# EAGLE design adafruit_breakout_shield (EAGLE 6.6.0)
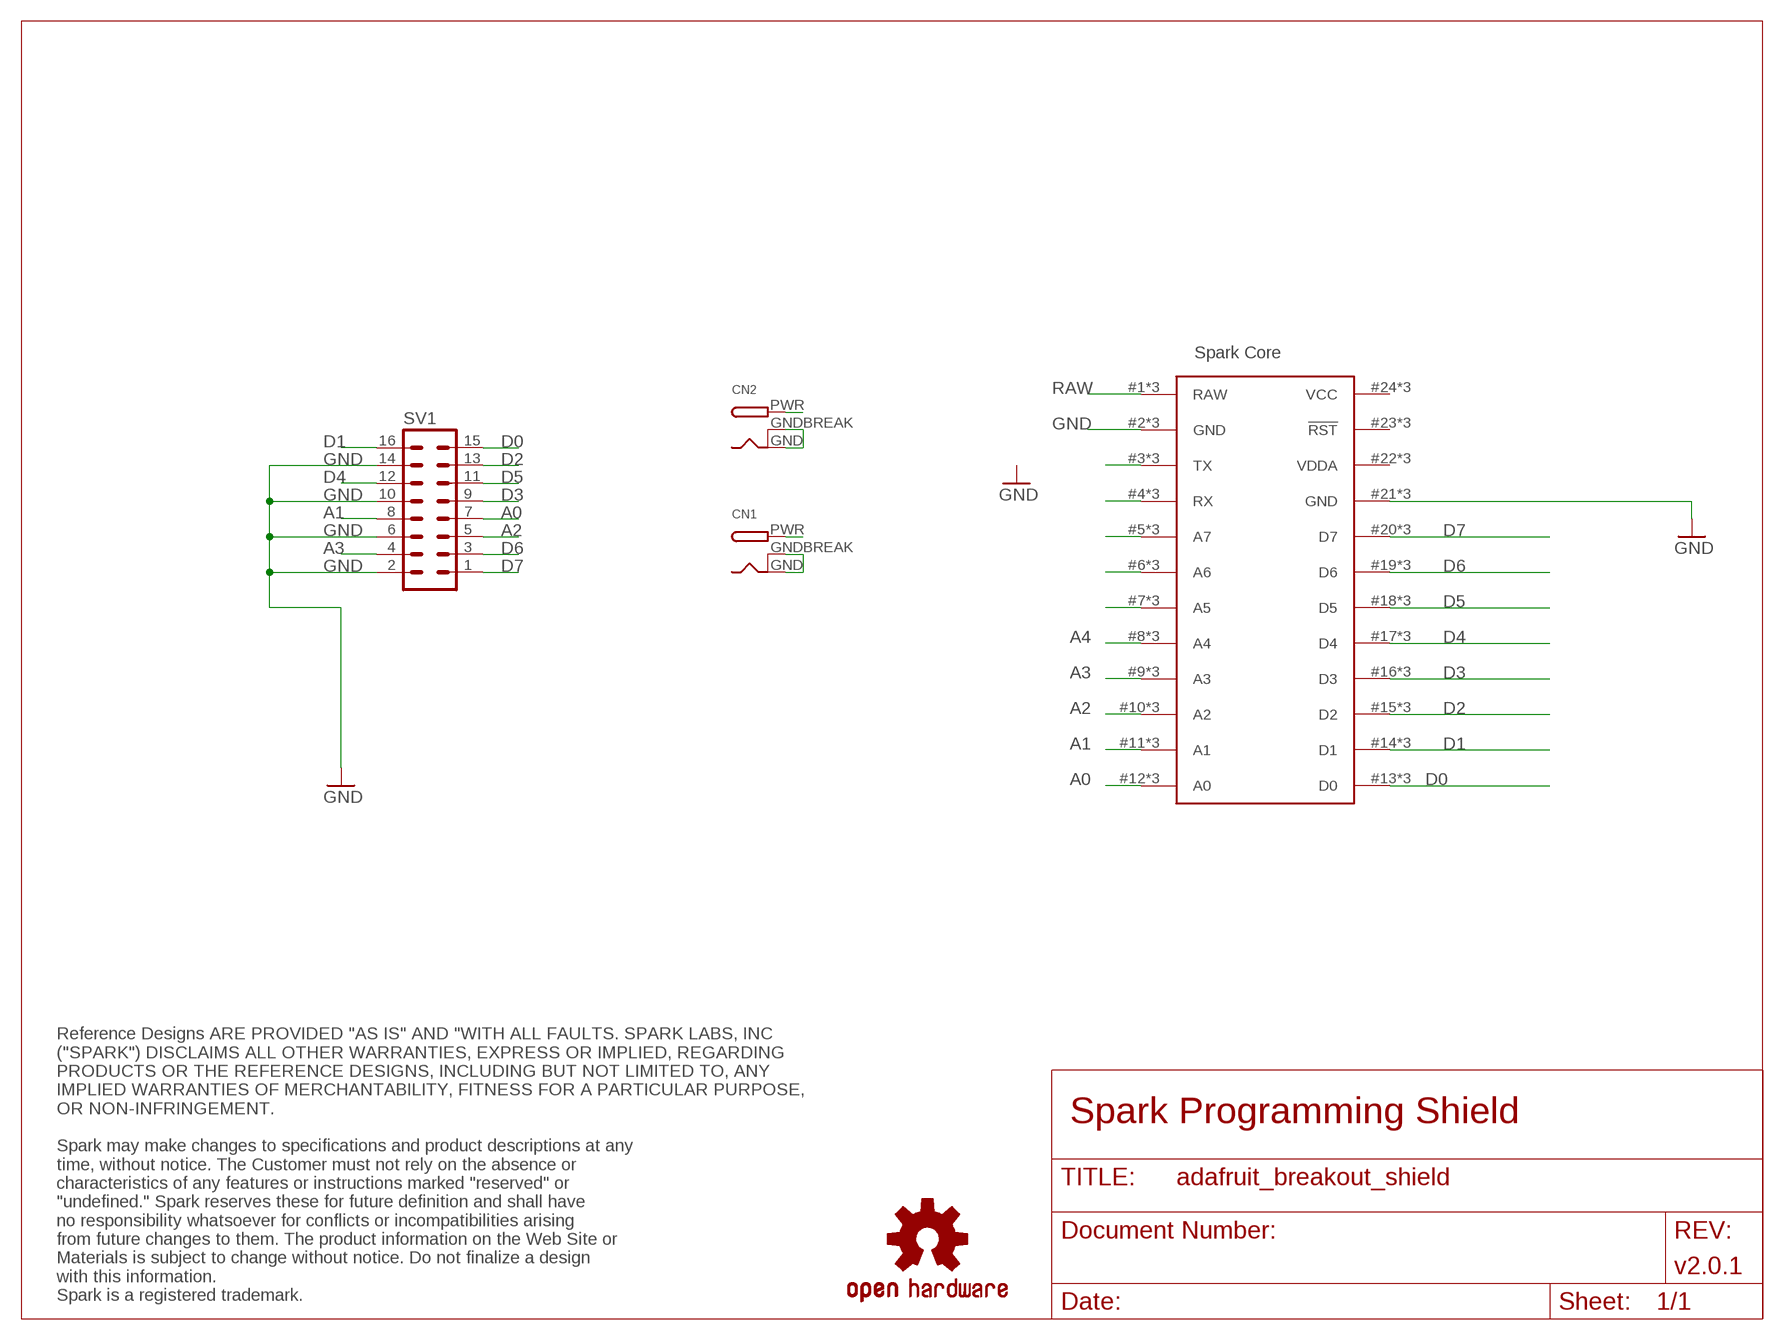
[diagram p0: schematic, sheet 1]

## Parts
CN1  DCBARRELPTH  [DCJACK_2MM_PTH]
CN2  DCBARRELPTH  [DCJACK_2MM_PTH]
LOGO1  OSHW-LOGOM  [OSHW-LOGO-M]
SV1  ML16  [ML16]
U$1  SPARK_CORE  [SPARK_CORE_STACKABLE]

## Nets
A0: SV1.7 U$1.12(A0) U$1.#12(A0) U$1.@12(A0)
A1: SV1.8 U$1.11(A1) U$1.#11(A1) U$1.@11(A1)
A2: SV1.5 U$1.10(A2) U$1.#10(A2) U$1.@10(A2)
A3: SV1.4 U$1.9(A3) U$1.#9(A3) U$1.@9(A3)
A4: U$1.8(A4) U$1.#8(A4) U$1.@8(A4)
D0: SV1.15 U$1.13(D0) U$1.#13(D0) U$1.@13(D0)
D1: SV1.16 U$1.14(D1) U$1.#14(D1) U$1.@14(D1)
D2: SV1.13 U$1.15(D2) U$1.#15(D2) U$1.@15(D2)
D3: SV1.9 U$1.16(D3) U$1.#16(D3) U$1.@16(D3)
D4: SV1.12 U$1.17(D4) U$1.#17(D4) U$1.@17(D4)
D5: SV1.11 U$1.18(D5) U$1.#18(D5) U$1.@18(D5)
D6: SV1.3 U$1.19(D6) U$1.#19(D6) U$1.@19(D6)
D7: SV1.1 U$1.20(D7) U$1.#20(D7) U$1.@20(D7)
GND: CN1.GND CN1.GNDBREAK CN2.GND CN2.GNDBREAK SV1.2 SV1.6 SV1.10 SV1.14 U$1.2(GND) U$1.21(GND) U$1.#2(GND) U$1.#21(GND) U$1.@2(GND) U$1.@21(GND)
N$1: U$1.7(A5) U$1.#7(A5) U$1.@7(A5)
N$2: U$1.6(A6) U$1.#6(A6) U$1.@6(A6)
N$3: U$1.5(A7) U$1.#5(A7) U$1.@5(A7)
N$4: U$1.4(RX) U$1.#4(RX) U$1.@4(RX)
N$5: U$1.3(TX) U$1.#3(TX) U$1.@3(TX)
RAW: CN1.PWR CN2.PWR U$1.1(RAW) U$1.#1(RAW) U$1.@1(RAW)
Unconnected: U$1.23(!RST) U$1.#23(!RST) U$1.@23(!RST)

## Notes on the sheet
- Spark Core
- Spark Programming Shield
- v2.0.1
- Reference Designs ARE PROVIDED "AS IS" AND "WITH ALL FAULTS. SPARK LABS, INC 
  ("SPARK") DISCLAIMS ALL OTHER WARRANTIES, EXPRESS OR IMPLIED, REGARDING 
  PRODUCTS OR THE REFERENCE DESIGNS, INCLUDING BUT NOT LIMITED TO, ANY 
  IMPLIED WARRANTIES OF MERCHANTABILITY, FITNESS FOR A PARTICULAR PURPOSE,
  OR NON-INFRINGEMENT.
  
  Spark may make changes to specifications and product descriptions at any 
  time, without notice. The Customer must not rely on the absence or 
  characteristics of any features or instructions marked "reserved" or 
  "undefined." Spark reserves these for future definition and shall have 
  no responsibility whatsoever for conflicts or incompatibilities arising 
  from future changes to them. The product information on the Web Site or 
  Materials is subject to change without notice. Do not finalize a design 
  with this information. 
  Spark is a registered trademark.

## Power pins joined to a net without a drawn wire
VCC: U$1.24(VCC) U$1.#24(VCC) U$1.@24(VCC)
VDDA: U$1.22(VDDA) U$1.#22(VDDA) U$1.@22(VDDA)

## Library data of the parts
CN1 CN2 = adafruit:DCBARREL: 2.0mm DC Barrel Jack DCJACK_2MM_PTH - Through Hole Jack (4UConnector: 05537)
LOGO1 = Spark:OSHW-LOGO: Open Source Hardware Logo This logo indicates the piece of hardware it is found on incorporates a OSHW license and/or adheres to the definition of open source hardware found here: http://freedomdefined.org/OSHW
SV1 = con-harting-ml:ML16: HARTING; OC_FARNELL: unknown; OC_NEWARK: unknown
U$1 = Spark:SPARK_CORE

## Board
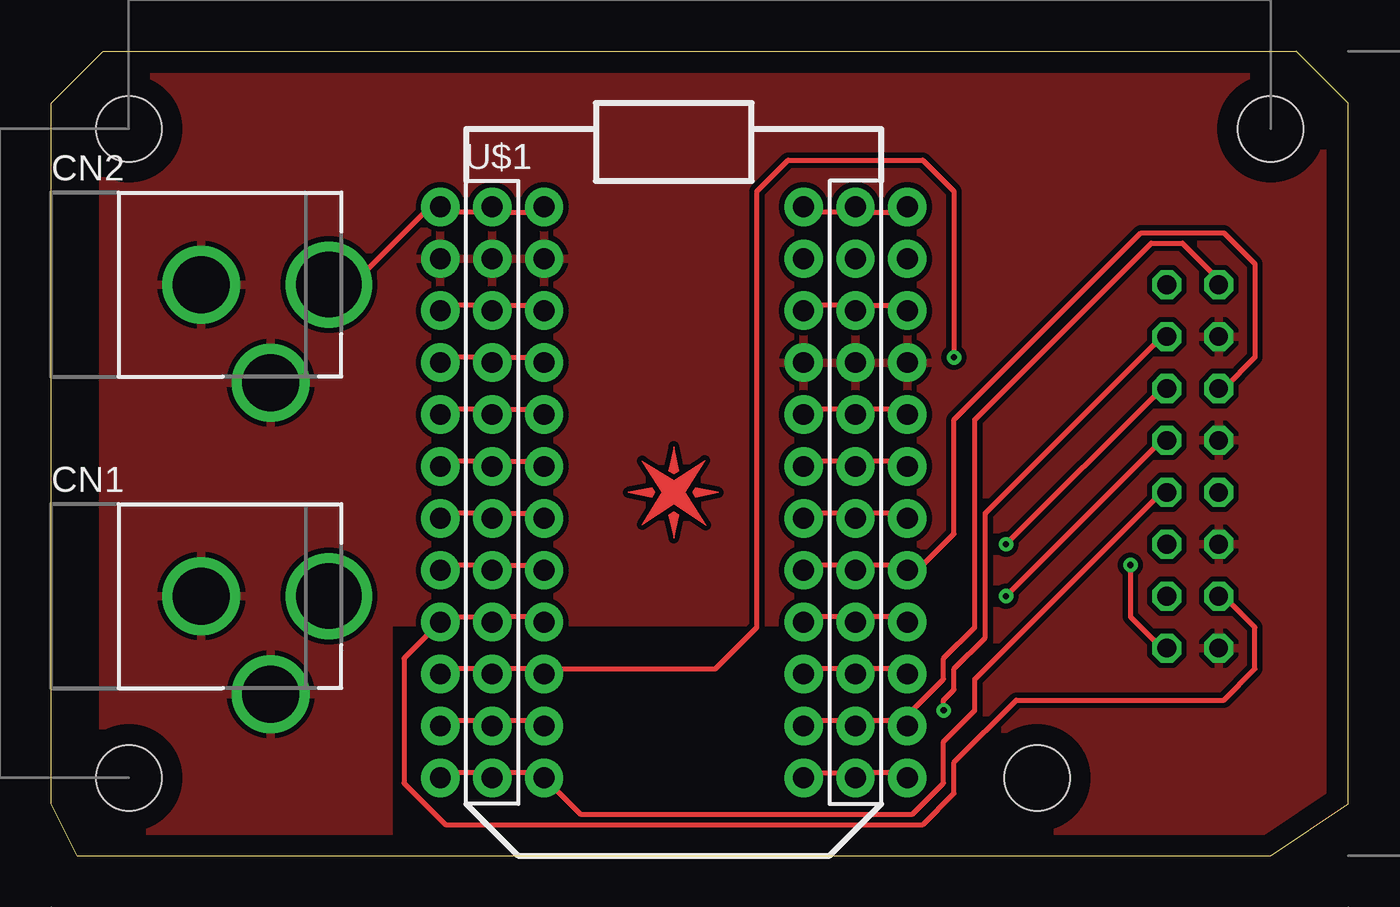
[diagram p1: board, top side]
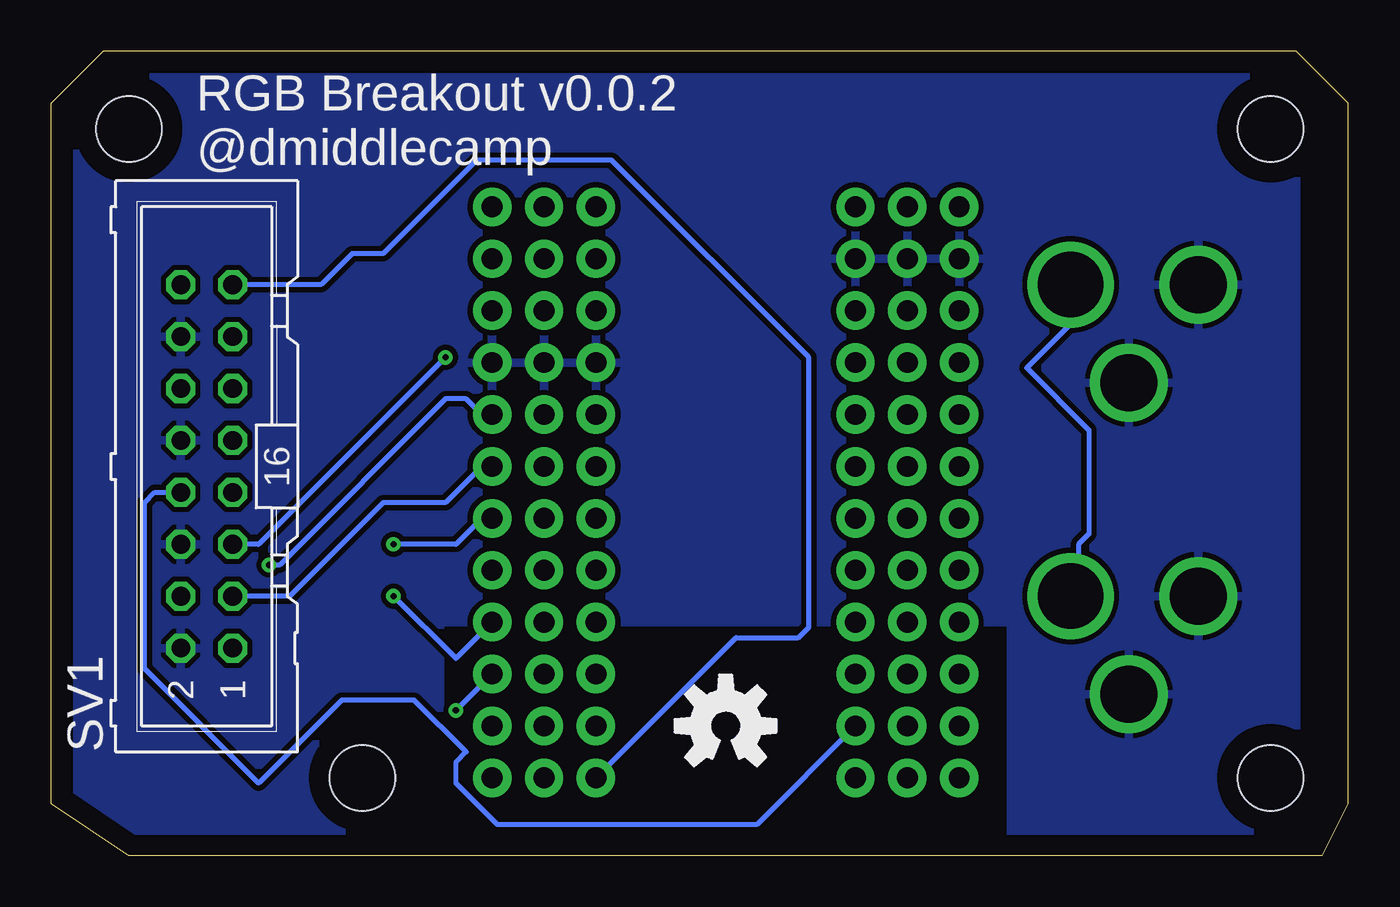
[diagram p2: board, bottom side, seen from below]

Size 63.5 x 39.37 mm. Coordinates in mm from the lower left corner, seen from the top.
Outline: 1.27,0 0,2.54 0,36.83 2.54,39.37 60.96,39.37 63.5,36.83 63.5,2.54 59.69,0 1.27,0
Copper layers (1*16): Top 0.035mm / dielectric 1.5mm / Bottom 0.035mm
Design rules "default *": minimum track width 10mil, minimum drill 0.3mm, track to track 10mil, track to pad 10mil, pad to pad 10mil, via to via 10mil, smd to smd 10mil, copper to edge 40mil, drill to drill 8mil, minimum pad ring 10mil, minimum via ring 8mil, stop-mask expansion 4mil, vias tented up to drill 0mil, thermal gap 10mil
Holes 3.2 mm at 59.69,35.56 48.26,3.81 3.81,3.81 3.81,35.56

### Footprints (pad centres in the part's own frame; a part is rotated, then mirrored left to right if it is on the bottom)
DCJACK_2MM_PTH = drill 2.8: GND 0,7.35; GNDBREAK 4.8,10.75 | drill 3.2: PWR 0,13.6
ML16 = drill 0.914 octagon: 1 -8.89,-1.27; 2 -8.89,1.27; 3 -6.35,-1.27; 4 -6.35,1.27; 5 -3.81,-1.27; 6 -3.81,1.27; 7 -1.27,-1.27; 8 -1.27,1.27; 9 1.27,-1.27; 10 1.27,1.27; 11 3.81,-1.27; 12 3.81,1.27; 13 6.35,-1.27; 14 6.35,1.27; 15 8.89,-1.27; 16 8.89,1.27
SPARK_CORE_STACKABLE = drill 1.016 pad 1.88: 1 -8.89,13.97; 2 -8.89,11.43; 3 -8.89,8.89; 4 -8.89,6.35; 5 -8.89,3.81; 6 -8.89,1.27; 7 -8.89,-1.27; 8 -8.89,-3.81; 9 -8.89,-6.35; 10 -8.89,-8.89; 11 -8.89,-11.43; 12 -8.89,-13.97; 13 8.89,-13.97; 14 8.89,-11.43; 15 8.89,-8.89; 16 8.89,-6.35; 17 8.89,-3.81; 18 8.89,-1.27; 19 8.89,1.27; 20 8.89,3.81; 21 8.89,6.35; 22 8.89,8.89; 23 8.89,11.43; 24 8.89,13.97; #1 -6.35,13.97; #2 -6.35,11.43; #3 -6.35,8.89; #4 -6.35,6.35; #5 -6.35,3.81; #6 -6.35,1.27; #7 -6.35,-1.27; #8 -6.35,-3.81; #9 -6.35,-6.35; #10 -6.35,-8.89; #11 -6.35,-11.43; #12 -6.35,-13.97; #13 11.43,-13.97; #14 11.43,-11.43; #15 11.43,-8.89; #16 11.43,-6.35; #17 11.43,-3.81; #18 11.43,-1.27; #19 11.43,1.27; #20 11.43,3.81; #21 11.43,6.35; #22 11.43,8.89; #23 11.43,11.43; #24 11.43,13.97; @1 -11.43,13.97; @2 -11.43,11.43; @3 -11.43,8.89; @4 -11.43,6.35; @5 -11.43,3.81; @6 -11.43,1.27; @7 -11.43,-1.27; @8 -11.43,-3.81; @9 -11.43,-6.35; @10 -11.43,-8.89; @11 -11.43,-11.43; @12 -11.43,-13.97; @13 6.35,-13.97; @14 6.35,-11.43; @15 6.35,-8.89; @16 6.35,-6.35; @17 6.35,-3.81; @18 6.35,-1.27; @19 6.35,1.27; @20 6.35,3.81; @21 6.35,6.35; @22 6.35,8.89; @23 6.35,11.43; @24 6.35,13.97

### Placement (x,y rotation side)
CN1  0,12.7 270 top
CN2  0,27.94 270 top
E$1  [SPARK_LOGO_PLUS_PLANE]  30.48,17.78 0 top
LOGO1  30.48,6.35 0 bottom
SV1  55.88,19.05 90 bottom
U$1  30.48,17.78 0 top

### Tracks (layer width: path | path; a pad name or v marks a point on that pad's centre or on a via)
A0
  Top 0.254: U$1.@12 19.3,4.06 21.34,4.06 U$1.12 21.84,4.06 23.88,4.06 U$1.#12 25.91,2.03 42.16,2.03 43.69,3.56 43.69,5.59 45.21,7.11 45.21,8.64 54.36,17.78 SV1.7
A1
  Top 0.254: U$1.@11 19.3,6.6 21.34,6.6 U$1.11 21.84,6.6 23.88,6.6 U$1.#11
  Bottom 0.254: SV1.8 58.42,17.78 58.93,17.27 58.93,9.14 53.34,3.56 49.28,7.62 45.72,7.62 43.18,5.08 43.69,4.57 43.69,3.56 41.66,1.52 28.96,1.52 U$1.#11
A2  (via drill 0.3)
  Top 0.254: U$1.@10 19.3,9.14 21.34,9.14 U$1.10 21.84,9.14 23.88,9.14 U$1.#10 24.38,9.14 32.51,9.14 34.54,11.18 34.54,32.51 36.07,34.04 42.67,34.04 44.2,32.51 v44.2,24.38
  Bottom 0.254: SV1.5 53.34,15.24 v44.2,24.38
A3
  Top 0.254: U$1.#9 23.88,11.68 21.84,11.68 U$1.9 21.34,11.68 19.3,11.68 U$1.@9 17.27,9.65 17.27,3.56 19.3,1.52 42.67,1.52 44.2,3.05 44.2,4.57 47.24,7.62 57.4,7.62 58.93,9.14 58.93,11.18 57.4,12.7 SV1.4
A4
  Top 0.254: U$1.@8 19.3,14.22 21.34,14.22 U$1.8 21.84,14.22 23.88,14.22 U$1.#8
D0
  Top 0.254: U$1.#13 41.66,4.06 39.62,4.06 U$1.13 39.12,4.06 37.08,4.06 U$1.@13
  Bottom 0.254: SV1.15 50.29,27.94 48.77,29.46 47.24,29.46 42.67,34.04 36.07,34.04 26.42,24.38 26.42,11.18 26.92,10.67 29.97,10.67 U$1.@13
D1
  Top 0.254: U$1.@14 37.08,6.6 39.12,6.6 U$1.14 39.62,6.6 41.66,6.6 | 41.66,6.6 43.69,8.64 43.69,9.65 45.21,11.18 45.21,21.34 53.85,29.97 55.37,29.97 56.9,28.45 56.9,27.94 SV1.16 | 41.66,6.6 U$1.#14
D2  (via drill 0.3)
  Top 0.254: U$1.@15 37.08,9.14 39.12,9.14 U$1.15 39.62,9.14 41.66,9.14 U$1.#15 | v43.69,7.11 43.69,7.62 44.2,8.13 44.2,9.14 45.72,10.67 45.72,16.76 54.36,25.4 SV1.13
  Bottom 0.254: U$1.#15 v43.69,7.11
D3  (via drill 0.3)
  Top 0.254: U$1.@16 37.08,11.68 39.12,11.68 U$1.16 39.62,11.68 41.66,11.68 U$1.#16 | v46.74,12.7 54.36,20.32 SV1.9
  Bottom 0.254: v46.74,12.7 43.69,9.65 U$1.#16
D4
  Top 0.254: U$1.@17 37.08,14.22 39.12,14.22 U$1.17 39.62,14.22 41.66,14.22 U$1.#17 42.16,13.72 44.2,15.75 44.2,21.34 53.34,30.48 57.4,30.48 58.93,28.96 58.93,24.38 57.4,22.86 SV1.12
D5  (via drill 0.3)
  Top 0.254: U$1.@18 37.08,16.76 39.12,16.76 U$1.18 39.62,16.76 41.66,16.76 U$1.#18 | v46.74,15.24 54.36,22.86 SV1.11
  Bottom 0.254: v46.74,15.24 43.69,15.24 42.16,16.76 U$1.#18
D6
  Top 0.254: U$1.@19 37.08,19.3 39.12,19.3 U$1.19 39.62,19.3 41.66,19.3 U$1.#19
  Bottom 0.254: SV1.3 51.82,12.7 47.24,17.27 44.2,17.27 42.16,19.3 U$1.#19
D7  (via drill 0.3)
  Top 0.254: U$1.@20 37.08,21.84 39.12,21.84 U$1.20 39.62,21.84 41.66,21.84 U$1.#20 | v52.83,14.22 52.83,11.68 54.36,10.16 SV1.1
  Bottom 0.254: v52.83,14.22 52.32,14.22 44.2,22.35 43.18,22.35 42.16,21.34 U$1.#20
GND
  pour Bottom: 2.54,38.1 2.54,0 16.51,0 16.51,11.43 44.45,11.43 44.45,0 62.23,0 62.23,38.1
  pour Top: 2.54,0 2.54,38.1 62.23,38.1 62.23,0 44.45,0 44.45,11.43 16.51,11.43 16.51,0
N$1
  Top 0.254: U$1.@7 19.3,16.76 21.34,16.76 U$1.7 21.84,16.76 23.88,16.76 U$1.#7
N$2
  Top 0.254: U$1.@6 19.3,19.3 21.34,19.3 U$1.6 21.84,19.3 23.88,19.3 U$1.#6
N$3
  Top 0.254: U$1.@5 19.3,21.84 21.34,21.84 U$1.5 21.84,21.84 23.88,21.84 U$1.#5
N$4
  Top 0.254: U$1.@4 19.3,24.38 21.34,24.38 U$1.4 21.84,24.38 23.88,24.38 U$1.#4
N$5
  Top 0.254: U$1.@3 19.3,26.92 21.34,26.92 U$1.3 21.84,26.92 23.88,26.92 U$1.#3
RAW
  Top 0.254: U$1.#1 23.88,31.5 21.84,31.5 U$1.1 21.34,31.5 19.3,31.5 U$1.@1 18.8,31.5 18.29,31.5 14.73,27.94 CN2.PWR
  Bottom 0.254: CN1.PWR 13.21,12.7 13.21,15.24 12.7,15.75 12.7,20.83 15.75,23.88 13.72,25.91 13.72,27.94 CN2.PWR
VCC
  Top 0.254: U$1.@24 37.08,31.5 39.12,31.5 U$1.24 39.62,31.5 41.66,31.5 U$1.#24
VDDA
  Top 0.254: U$1.@22 37.08,26.92 39.12,26.92 U$1.22 39.62,26.92 41.66,26.92 U$1.#22

### Text on the board
bPlace: RGB Breakout v0.0.2 / @dmiddlecamp
tDocu: Reference Designs ARE PROVIDED "AS IS" AND "WITH ALL FAULTS. SPARK LABS, INC / ("SPARK") DISCLAIMS ALL OTHER WARRANTIES, EXPRESS OR IMPLIED, REGARDING / PRODUCTS OR THE REFERENCE DESIGNS, INCLUDING BUT NOT LIMITED TO, ANY / IMPLIED WARRANTIES OF MERCHANTABILITY, FITNESS FOR A PARTICULAR PURPOSE, / OR NON-INFRINGEMENT. / / Spark may make changes to specifications and product descriptions at any / time, without notice. The Customer must not rely on the absence or / characteristics of any features or instructions marked "reserved" or / "undefined." Spark reserves these for future definition and shall have / no responsibility whatsoever for conflicts or incompatibilities arising / from future changes to them. The product information on the Web Site or / Materials is subject to change without notice. Do not finalize a design / with this information. / Spark is a registered trademark.